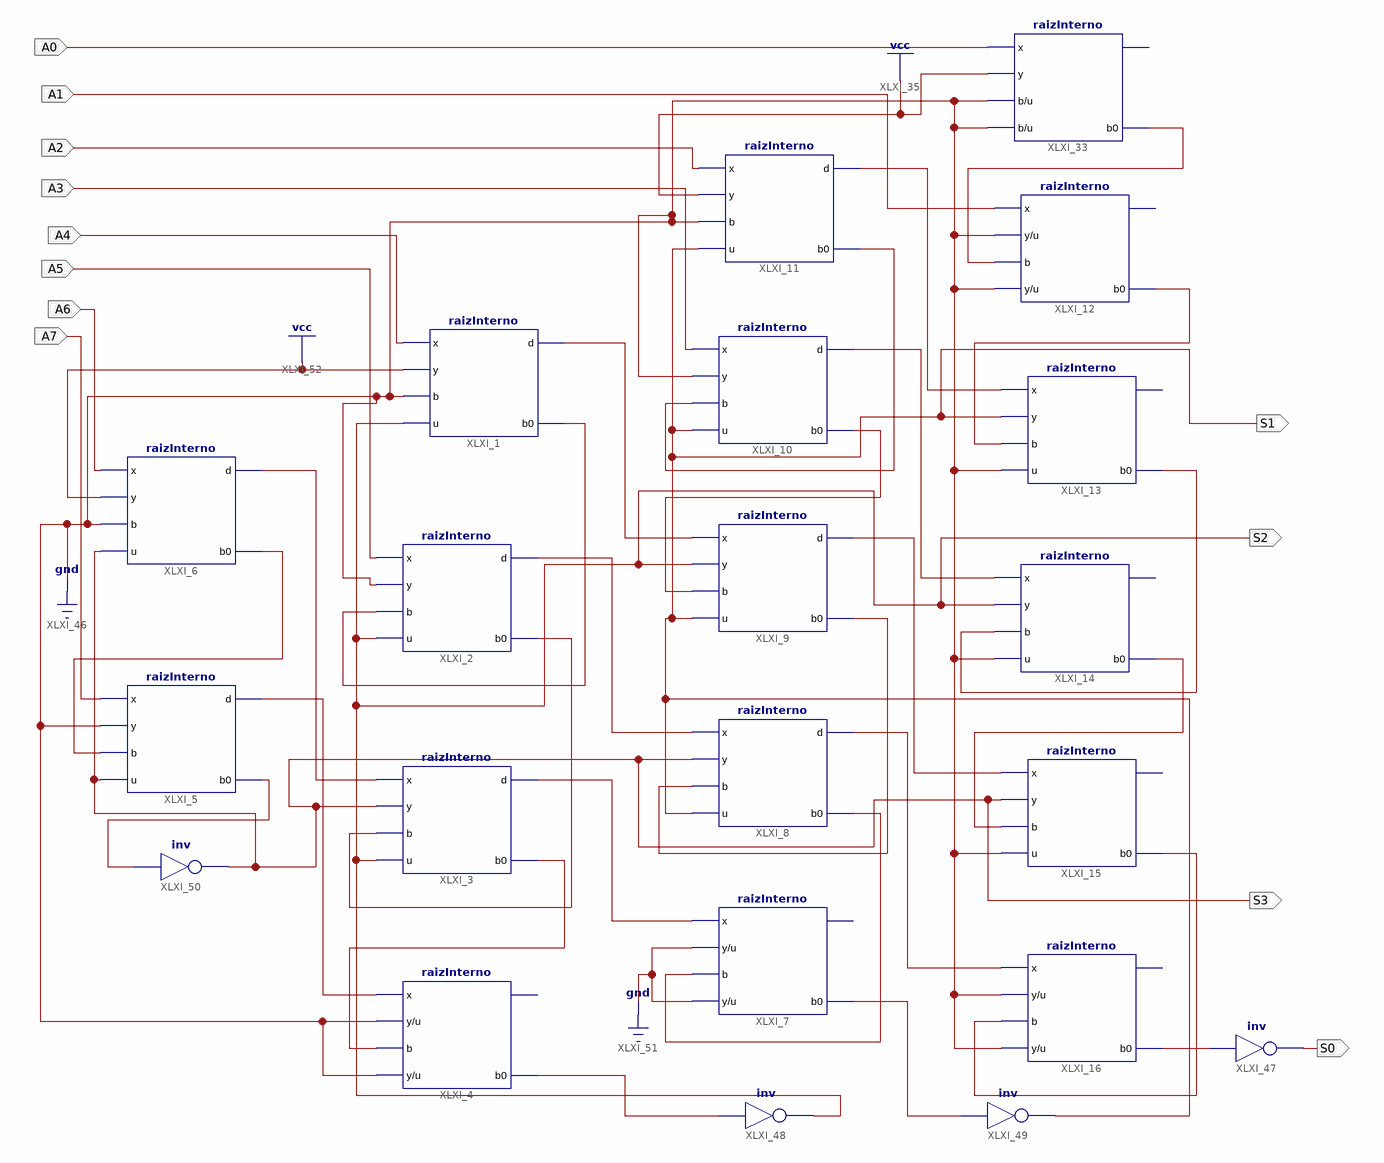
[diagram p0: schematic sheet 1]
// Xilinx ISE schematic Raiz.sch (spartan3e) as structural Verilog: 21 symbols, 12 ports
module Raiz (
  input  A0,
  input  A1,
  input  A2,
  input  A3,
  input  A4,
  input  A5,
  input  A6,
  input  A7,
  output S0,
  output S1,
  output S3,
  output S2
);

  wire XLXN_16, XLXN_17, XLXN_18, XLXN_19, XLXN_20, XLXN_21, XLXN_24, XLXN_25, XLXN_26, XLXN_27, XLXN_28,
       XLXN_29, XLXN_30, XLXN_42, XLXN_43, XLXN_44, XLXN_45, XLXN_46, XLXN_51, XLXN_52, XLXN_53, XLXN_67,
       XLXN_68, XLXN_80, XLXN_86, XLXN_87;

  raizInterno XLXI_1 (.x(A4), .y(1'b1), .b(1'b0), .u(S2), .d(XLXN_51), .b0(XLXN_27));
  raizInterno XLXI_2 (.x(A5), .y(1'b0), .b(XLXN_27), .u(S2), .d(XLXN_52), .b0(XLXN_28));
  raizInterno XLXI_3 (.x(XLXN_67), .y(S3), .b(XLXN_28), .u(S2), .d(XLXN_53), .b0(XLXN_29));
  raizInterno XLXI_4 (.x(XLXN_68), .y(1'b0), .b(XLXN_29), .u(1'b0), .b0(XLXN_87));  // open: d
  raizInterno XLXI_7 (.x(XLXN_53), .y(1'b0), .b(XLXN_26), .u(1'b0), .b0(XLXN_86));  // open: d
  raizInterno XLXI_8 (.x(XLXN_52), .y(S3), .b(XLXN_25), .u(S1), .d(XLXN_45), .b0(XLXN_26));
  raizInterno XLXI_9 (.x(XLXN_51), .y(S2), .b(XLXN_24), .u(S1), .d(XLXN_44), .b0(XLXN_25));
  raizInterno XLXI_10 (.x(A3), .y(1'b0), .b(XLXN_21), .u(S1), .d(XLXN_43), .b0(XLXN_24));
  raizInterno XLXI_5 (.x(A7), .y(1'b0), .b(XLXN_30), .u(S3), .d(XLXN_68), .b0(XLXN_80));
  raizInterno XLXI_6 (.x(A6), .y(1'b1), .b(1'b0), .u(S3), .d(XLXN_67), .b0(XLXN_30));
  raizInterno XLXI_11 (.x(A2), .y(1'b1), .b(1'b0), .u(S1), .d(XLXN_42), .b0(XLXN_21));
  raizInterno XLXI_13 (.x(XLXN_42), .y(S1), .b(XLXN_17), .u(1'b0), .b0(XLXN_18));  // open: d
  raizInterno XLXI_12 (.x(A1), .y(1'b0), .b(XLXN_16), .u(1'b0), .b0(XLXN_17));  // open: d
  raizInterno XLXI_33 (.x(A0), .y(1'b1), .b(1'b0), .u(1'b0), .b0(XLXN_16));  // open: d
  raizInterno XLXI_14 (.x(XLXN_43), .y(S2), .b(XLXN_18), .u(1'b0), .b0(XLXN_19));  // open: d
  raizInterno XLXI_15 (.x(XLXN_44), .y(S3), .b(XLXN_19), .u(1'b0), .b0(XLXN_20));  // open: d
  raizInterno XLXI_16 (.x(XLXN_45), .y(1'b0), .b(XLXN_20), .u(1'b0), .b0(XLXN_46));  // open: d
  not XLXI_47 (S0, XLXN_46);
  not XLXI_48 (S2, XLXN_87);
  not XLXI_49 (S1, XLXN_86);
  not XLXI_50 (S3, XLXN_80);
endmodule
